# EAGLE board BIM_V2 (EAGLE 9.1.3)
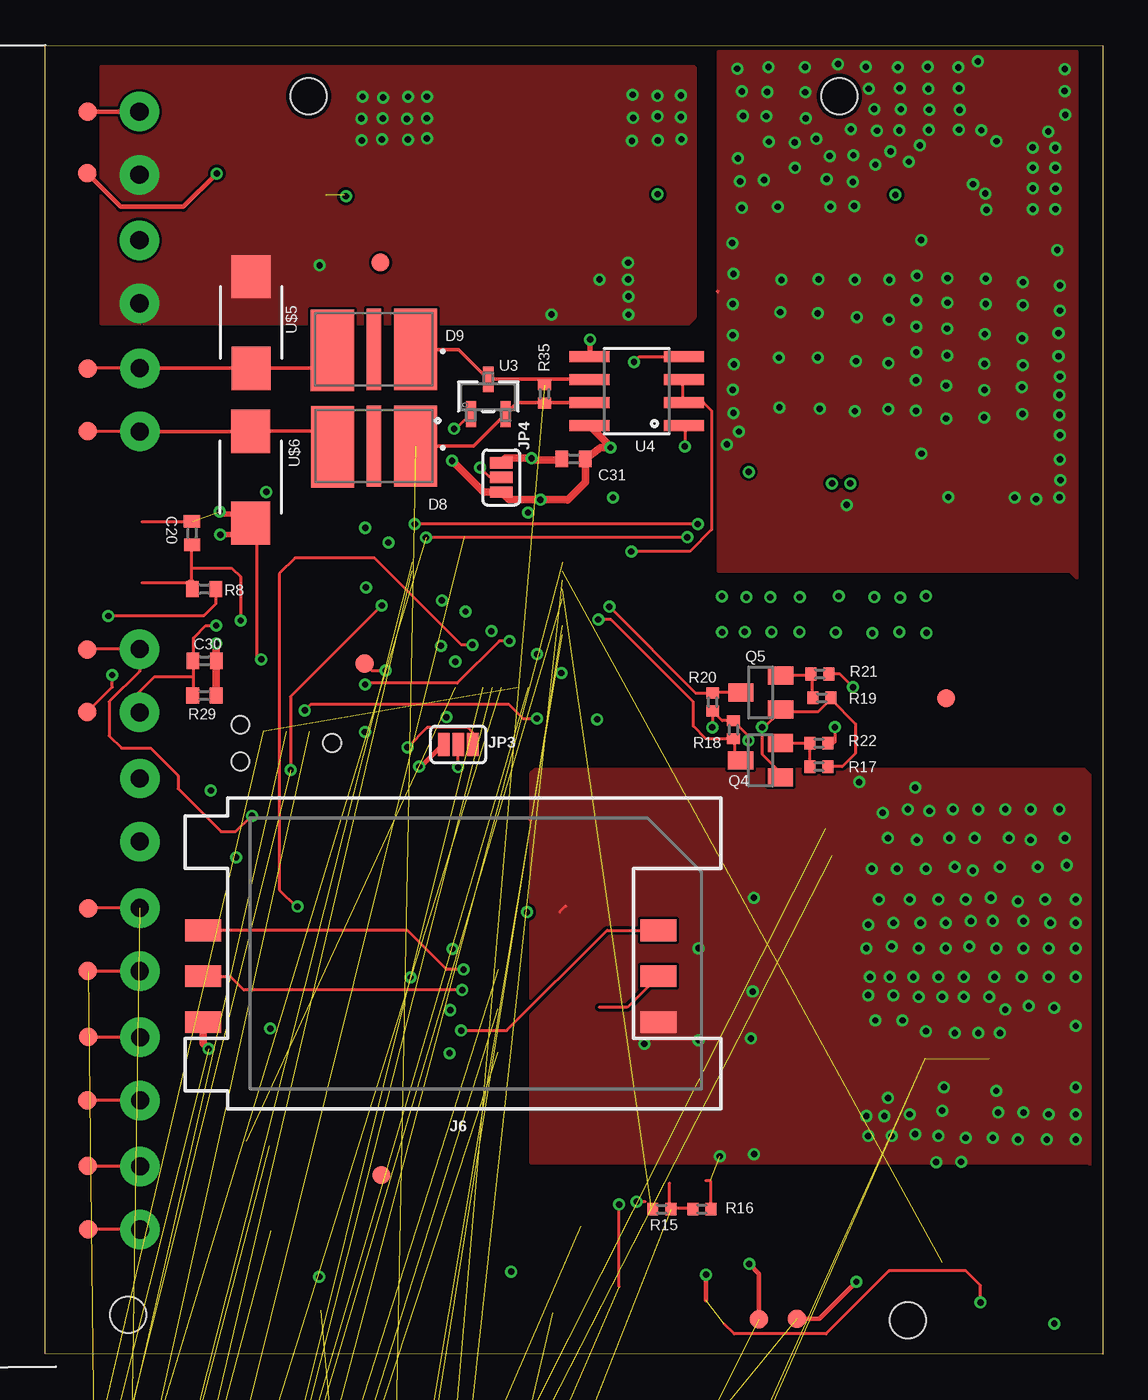
[diagram p7: board, top side]
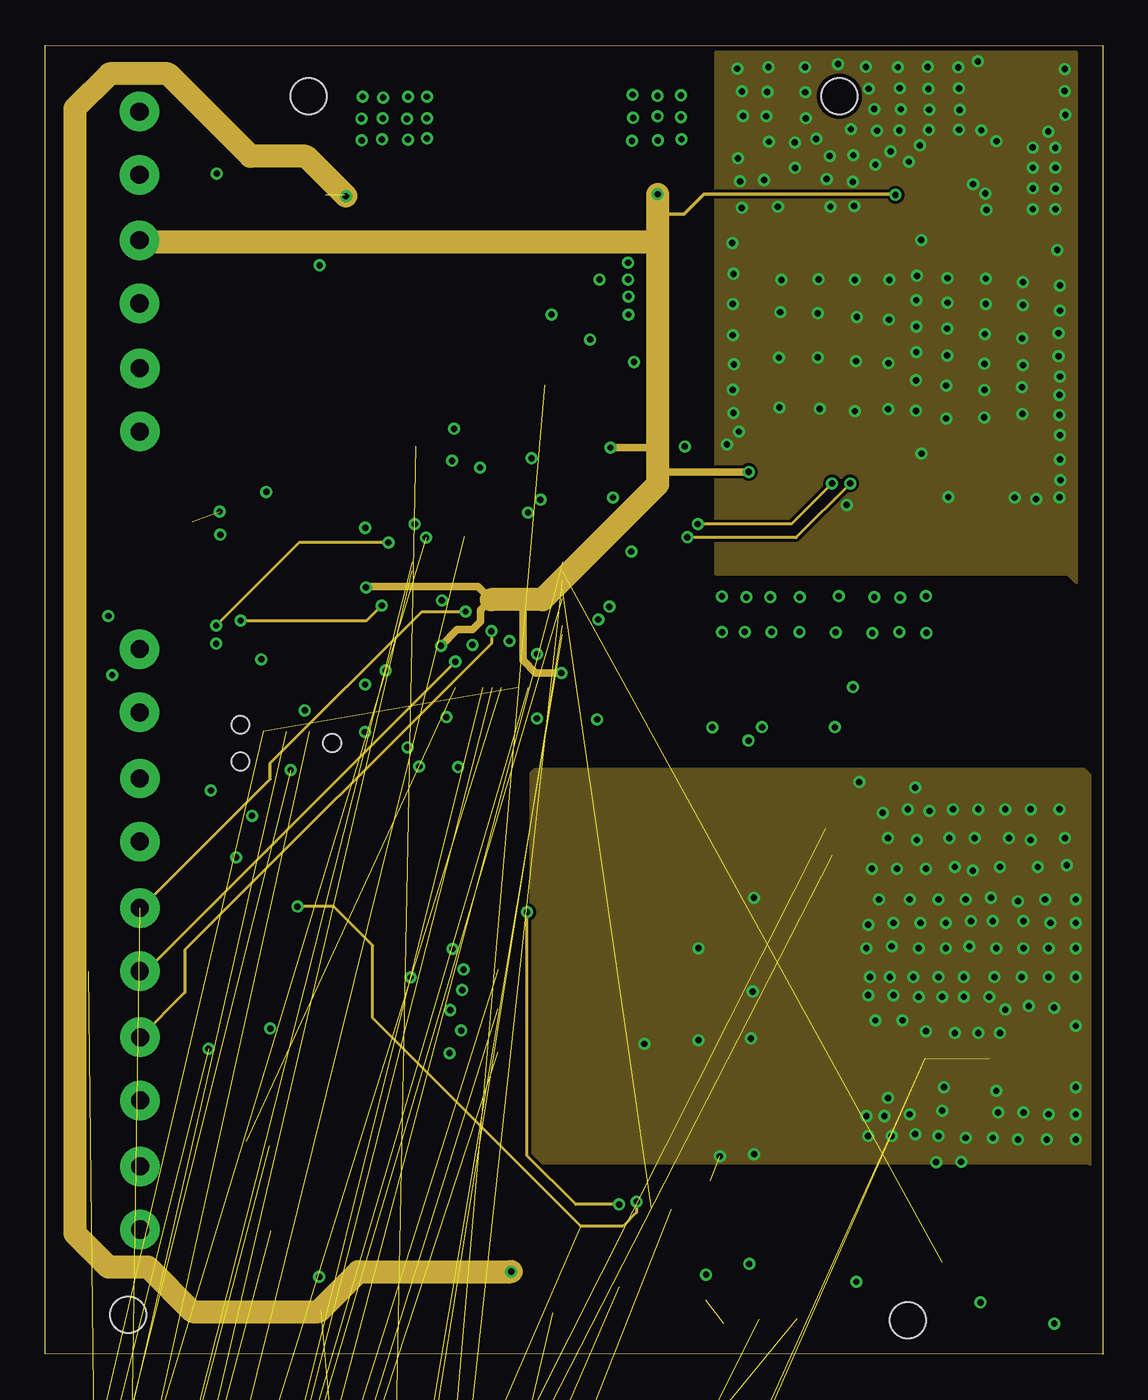
[diagram p8: board, inner layer Route2]
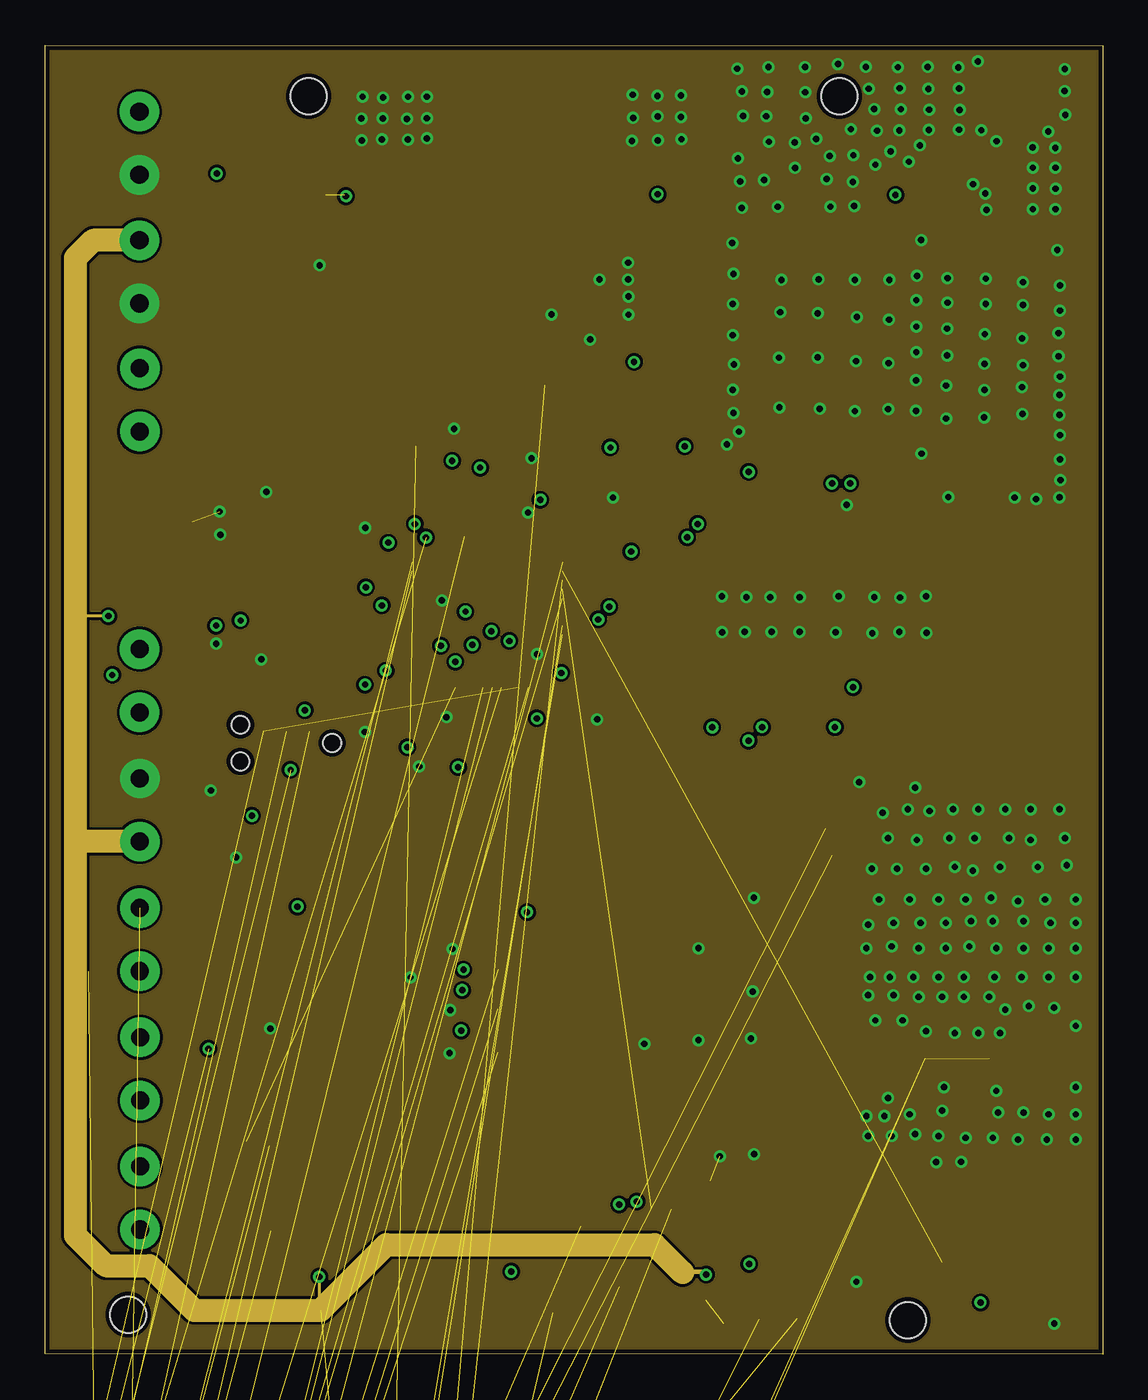
[diagram p9: board, inner layer Route15]
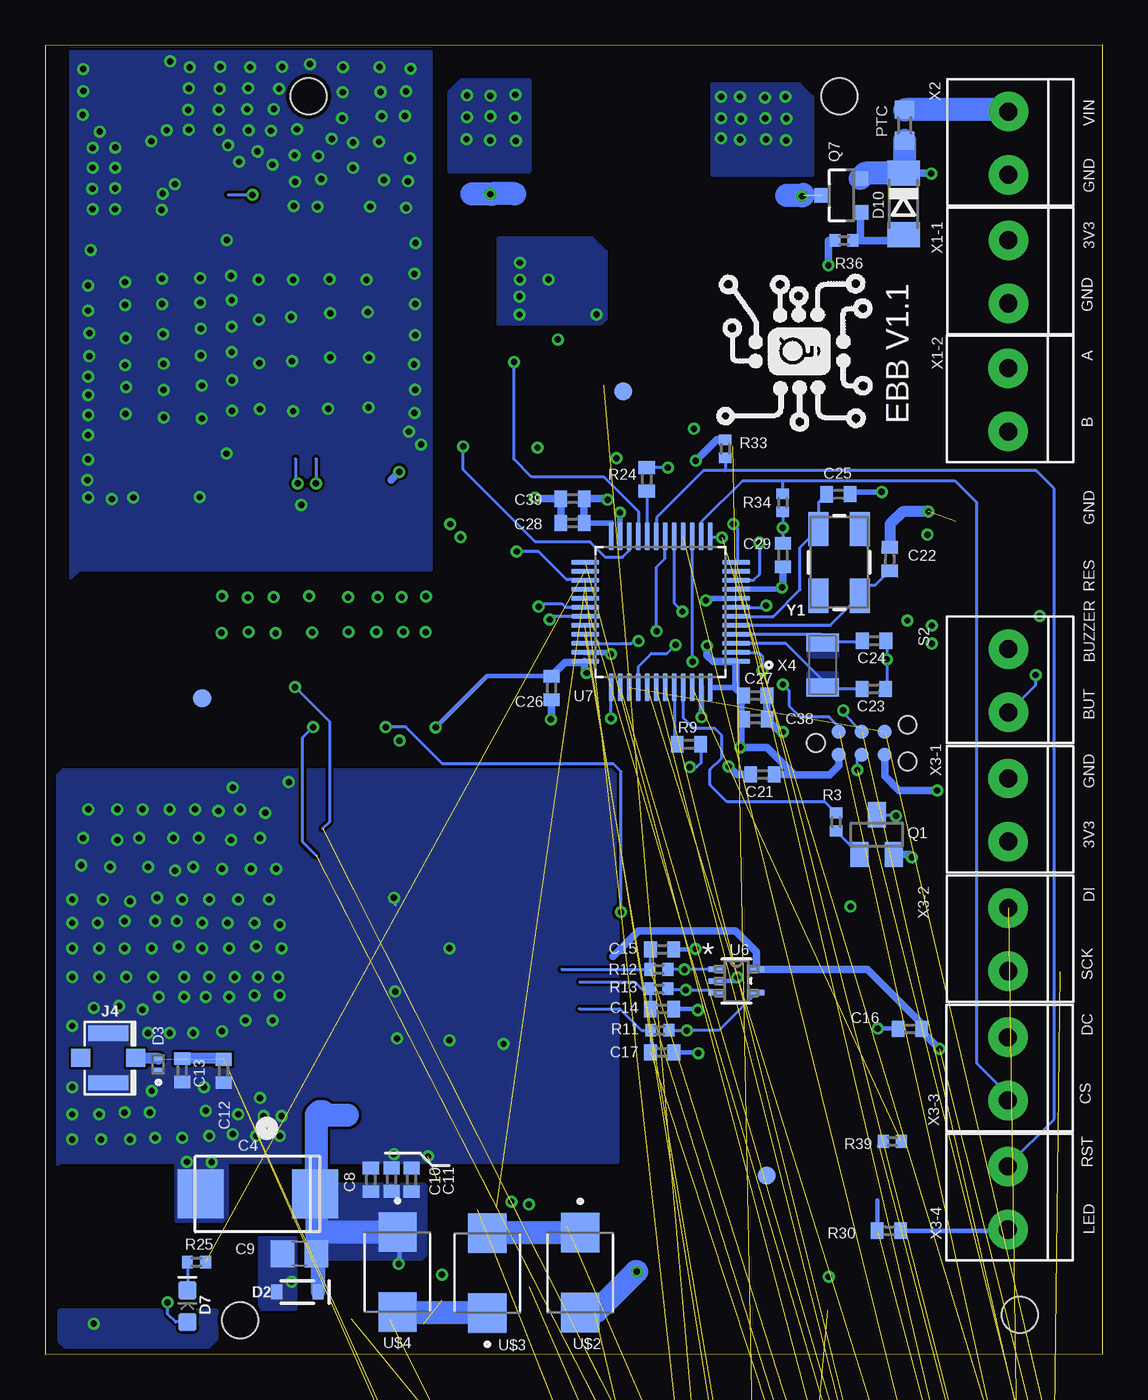
[diagram p10: board, bottom side, seen from below]

Size 58.6 x 72.53 mm. Coordinates in mm from the lower left corner, seen from the top.
Outline: 58.6,0 0,0.02 0,72.53 58.6,72.5 58.6,0
Copper layers (1+2*15+16): Top 0.035mm / dielectric 0.11mm / Route2 0.035mm / dielectric 0.6mm / Route15 0.035mm / dielectric 0.11mm / Bottom 0.035mm
Design rules "default *": minimum track width 6mil, minimum drill 0.35mm, track to track 6mil, track to pad 6mil, pad to pad 6mil, via to via 6mil, smd to smd 2mil, copper to edge 10mil, drill to drill 6mil, minimum pad ring 10mil, minimum via ring 4mil, stop-mask expansion 4mil, vias tented up to drill 0.4mm, thermal gap 0mil
Net classes: 1 power: width 0.254 mm, drill 0.2 mm; 2 signal: width 0.203 mm, drill 0.2 mm; 3 INPUT: width 0.203 mm, drill 0.005 mm
Holes 2 mm at 44,69.7 14.6,69.7 4.6,2.2 47.8,1.9

## Footprints (pad centres in the part's own frame; a part is rotated, then mirrored left to right if it is on the bottom)
CR1220 = smd 3.2 x 3.2: +$1 -8.225,0; +$2 8.225,0 | smd 6.35 x 6.35: - 0,0
C0402 = smd 0.7 x 0.9: 1 -0.65,0; 2 0.65,0
D/7343-31R = smd 2.55 x 2.7: + 3.175,0; - -3.175,0
0603-NO = smd 1.1 x 1: 1 -0.85,0; 2 0.85,0
C0805 = smd 1.3 x 1.5: 1 -0.95,0; 2 0.95,0
C0603 = smd 1.1 x 1: 1 -0.85,0; 2 0.85,0
SOD-323 = smd 0.63 x 0.83: A 1.15,0; C -1.15,0
DIODFN100X60X40-2N = smd 0.28 x 0.52: 1 -0.325,0; 2 0.325,0
LED-0603 = smd 1 x 1: A -0.877,0; C 0.877,0
DIOC650X400X100N = smd 2.4 x 4.5: 1 -2.3,0; 3 2.3,0.05 | smd 0.8 x 4.5: 2 0,0
SOD80C = smd 1.4 x 1.8: A 1.7,0; C -1.7,0
FIDUCIAL-1X2 = smd 1 x 1: 1 0,0
SOIC8_150MIL = smd 0.6 x 2.2: 1 -1.905,-2.6; 2 -0.635,-2.6; 3 0.635,-2.6; 4 1.905,-2.6; 5 1.905,2.6; 6 0.635,2.6; 7 -0.635,2.6; 8 -1.905,2.6
U.FL = smd 2.2 x 0.85: 1 0,1.375; 2 0,-1.375 | smd 1.05 x 1: FEED 1.525,0; NC -1.525,0
SIMHOLDER = smd 2 x 1.2: C1 -12.61,-3.81; C2 -12.61,-1.27; C3 -12.61,1.27; C5 12.61,-3.81; C6 12.61,-1.27; C7 12.61,1.27
SMT-JUMPER_3_2-NC_PASTE_SILK = smd 0.635 x 1.27: 1 -0.813,0; 2 0,0; 3 0.813,0
0603 = smd 1.1 x 1: 1 -0.85,0; 2 0.85,0
IND_2520_TDK = smd 0.856 x 2: 1 -1.178,0; 2 1.178,0
R0603 = smd 1 x 1.1: 1 -0.85,0; 2 0.85,0
SOT23 = smd 1 x 1.4: 1 -0.95,-1.1; 2 0.95,-1.1; 3 0,1.1
SOT-23F = smd 0.8 x 0.9: 1 -0.95,-1.05; 2 0.95,-1.05; 3 0,1.05
CRYSTAL_8X3.8 = smd 1.3 x 1.9: P$1 -2.75,-1.6; P$2 2.75,-1.6; P$3 2.75,1.6; P$4 -2.75,1.6
R0402 = smd 0.7 x 0.9: 1 -0.65,0; 2 0.65,0
R0402' = smd 0.6 x 0.7: 1 -0.5,0; 2 0.5,0
1X2-3.5MM = drill 1 pad 2.184: 1 1.8,0; 2 -1.7,0
PAD.03X.04 = smd 1.016 x 1.016: P$1 0,0
SOT-23_ONS = smd 0.559 x 1.422: 1 -0.953,-0.965; 2 0.953,-0.965; 3 0,0.965
SO08 = smd 0.61 x 2.21: 1 -1.905,-2.616; 2 -0.635,-2.616; 3 0.635,-2.616; 4 1.905,-2.616; 5 1.905,2.616; 6 0.635,2.616; 7 -0.635,2.616; 8 -1.905,2.616
SC-88A-5_1P35X2P2_ONS = smd 0.876 x 0.305: 1 -1.111,0.65; 2 -1.111,0; 3 -1.111,-0.65; 4 1.111,-0.65; 5 1.111,0.65
QFP50P900X900X160-48N = smd 1.56 x 0.28: 1 -4.18,2.75; 2 -4.18,2.25; 3 -4.18,1.75; 4 -4.18,1.25; 5 -4.18,0.75; 6 -4.18,0.25; 7 -4.18,-0.25; 8 -4.18,-0.75; 9 -4.18,-1.25; 10 -4.18,-1.75; 11 -4.18,-2.25; 12 -4.18,-2.75; 25 4.18,-2.75; 26 4.18,-2.25; 27 4.18,-1.75; 28 4.18,-1.25; 29 4.18,-0.75; 30 4.18,-0.25; 31 4.18,0.25; 32 4.18,0.75; 33 4.18,1.25; 34 4.18,1.75; 35 4.18,2.25; 36 4.18,2.75 | smd 0.28 x 1.56: 13 -2.75,-4.18; 14 -2.25,-4.18; 15 -1.75,-4.18; 16 -1.25,-4.18; 17 -0.75,-4.18; 18 -0.25,-4.18; 19 0.25,-4.18; 20 0.75,-4.18; 21 1.25,-4.18; 22 1.75,-4.18; 23 2.25,-4.18; 24 2.75,-4.18; 37 2.75,4.18; 38 2.25,4.18; 39 1.75,4.18; 40 1.25,4.18; 41 0.75,4.18; 42 0.25,4.18; 43 -0.25,4.18; 44 -0.75,4.18; 45 -1.25,4.18; 46 -1.75,4.18; 47 -2.25,4.18; 48 -2.75,4.18
SOIC8_4P9X3P9MC_MCH = smd 1.981 x 0.559: 1 -2.464,1.905; 2 -2.464,0.635; 3 -2.464,-0.635; 4 -2.464,-1.905; 5 2.464,-1.905; 6 2.464,-0.635; 7 2.464,0.635; 8 2.464,1.905
FIL_B39162B9417K610 = smd 0.18 x 0.25: 1 -0.385,0; 2 0,-0.25; 3 0.385,-0.25; 4 0.385,0.25; 5 0,0.25
SIMCON_SIM7000E = smd 2 x 0.6: 1 -12,8; 2 -12,7; 3 -12,6; 4 -12,5; 5 -12,4; 6 -12,3; 7 -12,2; 8 -12,1; 9 -12,0; 10 -12,-1; 11 -12,-2; 12 -12,-3; 13 -12,-4; 14 -12,-5; 15 -12,-6; 16 -12,-7; 17 -12,-8; 35 12,-8; 36 12,-7; 37 12,-6; 38 12,-5; 39 12,-4; 40 12,-3; 41 12,-2; 42 12,-1; 43 12,0; 44 12,1; 45 12,2; 46 12,3; 47 12,4; 48 12,5; 49 12,6; 50 12,7; 51 12,8 | smd 0.6 x 2: 18 -8,-12; 19 -7,-12; 20 -6,-12; 21 -5,-12; 22 -4,-12; 23 -3,-12; 24 -2,-12; 25 -1,-12; 26 0,-12; 27 1,-12; 28 2,-12; 29 3,-12; 30 4,-12; 31 5,-12; 32 6,-12; 33 7,-12; 34 8,-12; 52 8,12; 53 7,12; 54 6,12; 55 5,12; 56 4,12; 57 3,12; 58 2,12; 59 1,12; 60 0,12; 61 -1,12; 62 -2,12; 63 -3,12; 64 -4,12; 65 -5,12; 66 -6,12; 67 -7,12; 68 -8,12
SOIC8_208MIL = smd 0.6 x 2.2: 1 -1.905,-3.315; 2 -0.635,-3.315; 3 0.635,-3.315; 4 1.905,-3.315; 5 1.905,3.315; 6 0.635,3.315; 7 -0.635,3.315; 8 -1.905,3.315
SON50P300X300X80-11N = smd 0.8 x 0.3: 1 -1.45,1; 2 -1.45,0.5; 3 -1.45,0; 4 -1.45,-0.5; 5 -1.45,-1; 6 1.45,-1; 7 1.45,-0.5; 8 1.45,0; 9 1.45,0.5; 10 1.45,1 | smd 1.7 x 2.48: 11 0,0
J-LINK_6-PIN_ADAPTER_S = smd 0.787 x 0.787: P$1 -1.27,-0.635; P$2 -1.27,0.635; P$3 0,-0.635; P$4 0,0.635; P$5 1.27,-0.635; P$6 1.27,0.635 | hole 0.991: -2.54,0; 2.54,1.016; 2.54,-1.016
DIOM5436X261N = smd 2.18 x 2.12: A 2.215,0; C -2.215,0
DO-214AA = smd 2.4 x 2.16: 1 -2.54,0; 2 2.54,0
XTAL_3215_N = smd 1 x 1.8: 1 -1.25,0; 2 1.25,0
CRYSTAL-SMD-5X3.2-4PAD = smd 1.9 x 1.1: 1 -1.85,-1.15; 2 1.85,-1.15; 3 1.85,1.15; 4 -1.85,1.15

## Placement (x,y rotation side)
B2  CR1220  [CR1220]  not placed on the board
C1  10uF  [C0402]  not placed on the board
C3  10uF  [C0402]  not placed on the board
C4  1000uF  [D/7343-31R]  46.82,8.89 0 bottom
C5  0.1uF  [0603-NO]  not placed on the board
C8  0.1uF  [C0402]  40.56,9.67 90 bottom
C9  22uF  [C0805]  44.52,5.58 180 bottom
C10  47pF  [C0402]  38.3,9.68 90 bottom
C11  0.1uF  [C0402]  39.41,9.69 90 bottom
C12  0.3p DNP  [C0402]  48.71,15.7 270 bottom
C13  DNP  [C0402]  51.01,15.72 270 bottom
C14  33pF  [C0402]  24.42,19.13 0 bottom
C15  33pF  [C0402]  24.41,22.44 0 bottom
C16  0.1uF  [C0402]  10.69,18.03 180 bottom
C17  22pF  [C0402]  24.41,16.74 0 bottom
C18  2.4p DNP  [C0402]  not placed on the board
C19  DNP  [C0402]  not placed on the board
C20  1uF  [C0402]  8.14,45.49 90.4 top
C21  1uF  [C0402]  18.87,32.12 180 bottom
C22  20pF  [C0402]  11.81,44.05 269.5 bottom
C23  12pF  [C0402]  12.69,36.86 179.6 bottom
C24  12pF  [C0402]  12.67,39.53 180 bottom
C25  20pF  [C0402]  14.65,47.65 180.6 bottom
C26  0.1uF  [C0402]  30.54,36.92 270 bottom
C27  0.1uF  [C0402]  19.26,36.49 0 bottom
C28  0.1uF  [C0402]  29.39,46.06 180 bottom
C29  0.1uF  [C0402]  17.73,44.27 90 bottom
C30  1uF  [C0402]  8.84,38.42 0 top
C31  0.1uF  [C0402]  29.28,49.6 180 top
C32  0.1uF  [C0402]  not placed on the board
C33  10uF  [C0603]  not placed on the board
C34  0.1uF  [C0402]  not placed on the board
C36  10uF  [C0603]  not placed on the board
C38  1uF  [C0402]  19.25,35.19 0 bottom
C39  1uF  [C0402]  29.38,47.4 180 bottom
C47  22uF  [C0603]  not placed on the board
C48  10uF  [C0402]  not placed on the board
C73  0.1uF  [C0402]  not placed on the board
C74  0.1uF  [C0402]  not placed on the board
D2  5.1V  [SOD-323]  44.63,3.46 180 bottom
D3  D5V0L1B2LP4-7B  [DIODFN100X60X40-2N]  52.33,16.06 90 bottom
D6  Green  [LED-0603]  not placed on the board
D7  Red  [LED-0603]  50.71,2.67 90 bottom
D8  TBU-CA065-200-WH  [DIOC650X400X100N]  18.22,50.32 180 top
D9  TBU-CA065-200-WH  [DIOC650X400X100N]  18.22,55.67 180 top
D10  MMSZ5232B-E3-08  [SOD80C]  11.05,63.73 270 bottom
D12  Orange  [LED-0603]  not placed on the board
FD1  FIDUCIAL1X2  [FIDUCIAL-1X2]  26.57,53.36 0 bottom
FD2  FIDUCIAL1X2  [FIDUCIAL-1X2]  49.9,36.36 0 bottom
FD3  FIDUCIAL1X2  [FIDUCIAL-1X2]  18.63,9.91 0 bottom
FD4  FIDUCIAL1X2  [FIDUCIAL-1X2]  18.63,9.92 0 top
FD5  FIDUCIAL1X2  [FIDUCIAL-1X2]  49.91,36.36 0 top
FD6  FIDUCIAL1X2  [FIDUCIAL-1X2]  18.58,60.48 0 top
IC1  RTC_PCF8523T  [SOIC8_150MIL]  not placed on the board
J3  U.FL  [U.FL]  not placed on the board
J4  U.FL  [U.FL]  55.1,16.42 0 bottom
J6  NSIM-2-C  [SIMHOLDER]  21.36,22.21 0 top
JP3  JUMPER-SMT_3_2-NC_PASTE_SILK  [SMT-JUMPER_3_2-NC_PASTE_SILK]  22.89,33.79 0 top
JP4  JUMPER-SMT_3_2-NC_PASTE_SILK  [SMT-JUMPER_3_2-NC_PASTE_SILK]  25.27,48.58 270 top
L1  1uH DNP  [0603]  not placed on the board
L2  27uH  [0603]  not placed on the board
L3  MLP2520S1R5MT0S1  [IND_2520_TDK]  not placed on the board
PTC  PRG18BC1R0MM1RB  [R0603]  10.98,68.09 90 bottom
Q1  BSS123  [SOT23]  12.53,28.79 0 bottom
Q2  BSS123  [SOT23]  not placed on the board
Q3  BSS123  [SOT23]  not placed on the board
Q4  BSS123  [SOT23]  39.63,32.91 90 top
Q5  BSS123  [SOT23]  39.64,36.67 90 top
Q6  BSS123  [SOT23]  not placed on the board
Q7  SSM3J328R  [SOT-23F]  14.49,64.21 90 bottom
Q8  BSS123  [SOT23]  not placed on the board
Q9  BSS123  [SOT23]  not placed on the board
Q10  BSS123  [SOT23]  not placed on the board
Q11  32.768  [CRYSTAL_8X3.8]  not placed on the board
R1  4.7k  [R0402]  not placed on the board
R2  4.7k  [R0402]  not placed on the board
R3  1k  [R0402']  14.78,29.49 90 bottom
R5  60R  [R0402']  not placed on the board
R6  60R  [R0402']  not placed on the board
R8  10k  [R0402]  8.81,42.4 0 top
R9  100k  [R0402]  22.93,33.8 0 bottom
R10  10R  [R0402']  not placed on the board
R11  22R  [R0402']  24.55,17.96 0 bottom
R12  22R  [R0402']  24.59,21.32 0 bottom
R13  22R  [R0402']  24.59,20.26 0 bottom
R14  1k  [R0402]  not placed on the board
R15  4.7k  [R0402']  34.16,8.04 0 top
R16  4.7k  [R0402']  36.39,8.05 0 top
R17  10k  [R0402']  42.87,32.56 0 top
R18  10k  [R0402']  38.13,34.6 90 top
R19  10k  [R0402']  43.03,36.37 0 top
R20  10k  [R0402']  36.98,36.13 270 top
R21  1k  [R0402']  42.92,37.69 0 top
R22  1k  [R0402']  42.87,33.86 0 top
R23  10k  [R0402']  not placed on the board
R24  100k  [R0402]  25.27,48.48 90 bottom
R25  1k  [R0402']  50.21,5.11 0 bottom
R29  10k  [R0402]  8.83,36.5 180 top
R30  220R  [R0402]  11.85,6.85 180 bottom
R31  1k  [R0402']  not placed on the board
R32  1k  [R0402']  not placed on the board
R33  10k  [R0402']  20.91,50.16 270 bottom
R34  10k  [R0402']  17.73,47.17 90 bottom
R35  220R/120R  [R0402']  27.67,53.21 270 top
R36  1k  [R0402']  14.34,61.71 180 bottom
R39  1k  [R0402']  11.66,11.8 0 bottom
R40  10k  [R0402']  not placed on the board
R41  10k  [R0402']  not placed on the board
R42  10k  [R0402']  not placed on the board
R43  1k  [R0402']  not placed on the board
R44  1k  [R0402']  not placed on the board
R45  10k  [R0402']  not placed on the board
R46  10k  [R0402']  not placed on the board
R47  1k  [R0402']  not placed on the board
R48  4.7k  [R0402']  not placed on the board
R49  4.7k  [R0402']  not placed on the board
R50  1k  [R0402']  not placed on the board
R51  1k  [R0402']  not placed on the board
S2  1X2-3.5MM  [1X2-3.5MM]  5.23,37.27 90 bottom
S3  1X2-3.5MM  [1X2-3.5MM]  not placed on the board
S4  1X2-3.5MM  [1X2-3.5MM]  not placed on the board
TP1  TEST-POINT3X4  [PAD.03X.04]  2.36,68.84 0 top
TP2  TEST-POINT3X4  [PAD.03X.04]  41.65,1.98 0 top
TP3  TEST-POINT3X4  [PAD.03X.04]  2.32,65.43 0 top
TP4  TEST-POINT3X4  [PAD.03X.04]  not placed on the board
TP5  TEST-POINT3X4  [PAD.03X.04]  not placed on the board
TP6  TEST-POINT3X4  [PAD.03X.04]  not placed on the board
TP7  TEST-POINT3X4  [PAD.03X.04]  39.56,1.95 270 top
TP8  TEST-POINT3X4  [PAD.03X.04]  not placed on the board
TP10  TEST-POINT3X4  [PAD.03X.04]  not placed on the board
TP12  TEST-POINT3X4  [PAD.03X.04]  not placed on the board
TP13  TEST-POINT3X4  [PAD.03X.04]  17.7,38.28 270 top
TP14  TEST-POINT3X4  [PAD.03X.04]  2.34,39.04 0 top
TP15  TEST-POINT3X4  [PAD.03X.04]  2.34,35.59 0 top
TP16  TEST-POINT3X4  [PAD.03X.04]  2.38,24.7 0 top
TP17  TEST-POINT3X4  [PAD.03X.04]  2.36,21.25 0 top
TP18  TEST-POINT3X4  [PAD.03X.04]  2.39,17.58 0 top
TP19  TEST-POINT3X4  [PAD.03X.04]  2.34,14.08 0 top
TP20  TEST-POINT3X4  [PAD.03X.04]  2.37,10.44 0 top
TP21  TEST-POINT3X4  [PAD.03X.04]  2.38,6.93 0 top
TP23  TEST-POINT3X4  [PAD.03X.04]  2.36,54.6 0 top
TP24  TEST-POINT3X4  [PAD.03X.04]  2.36,51.15 0 top
TP30  TEST-POINT3X4  [PAD.03X.04]  not placed on the board
TP31  TEST-POINT3X4  [PAD.03X.04]  not placed on the board
TP32  TEST-POINT3X4  [PAD.03X.04]  not placed on the board
TP33  TEST-POINT3X4  [PAD.03X.04]  not placed on the board
TP34  TEST-POINT3X4  [PAD.03X.04]  not placed on the board
TP35  TEST-POINT3X4  [PAD.03X.04]  not placed on the board
U3  SESDONCAN1LT3G  [SOT-23_ONS]  24.55,53.05 0 top
U4  RS485SOIC  [SO08]  32.77,53.36 90 top
U6  SMF05T1G  [SC-88A-5_1P35X2P2_ONS]  20.3,20.68 0 bottom
U7  STM32F103C8T6  [QFP50P900X900X160-48N]  24.5,41.13 180 bottom
U8  ATA6561-GAQW-N  [SOIC8_4P9X3P9MC_MCH]  not placed on the board
U9  B39162B8813P810  [FIL_B39162B9417K610]  not placed on the board
U10  SIM7000E  [SIMCON_SIM7000E]  not placed on the board
U20  Generic SPI Flash  [SOIC8_208MIL]  not placed on the board
U40  ADP2504ACPZ-R7  [SON50P300X300X80-11N]  not placed on the board
U$1  J-LINK_6-PIN_ADAPTER-1  [J-LINK_6-PIN_ADAPTER_S]  13.36,33.87 0 bottom
U$2  0ohm 2010 resistor  [DIOM5436X261N]  28.95,4.53 270 bottom
U$3  0ohm 2010 resistor  [DIOM5436X261N]  34.1,4.51 90 bottom
U$4  HS3FB  [DIOM5436X261N]  39.08,4.56 270 bottom
U$5  TISP4240M3BJR-S  [DO-214AA]  11.4,57.16 270 top
U$6  TISP4240M3BJR-S  [DO-214AA]  11.4,48.59 90 top
X1-1  1X2-3.5MM  [1X2-3.5MM]  5.22,59.92 90 bottom
X1-2  1X2-3.5MM  [1X2-3.5MM]  5.25,52.83 90 bottom
X2  1X2-3.5MM  [1X2-3.5MM]  5.22,67.05 90 bottom
X3-1  1X2-3.5MM  [1X2-3.5MM]  5.25,30.1 90 bottom
X3-2  1X2-3.5MM  [1X2-3.5MM]  5.25,22.93 90 bottom
X3-3  1X2-3.5MM  [1X2-3.5MM]  5.26,15.77 90 bottom
X3-4  1X2-3.5MM  [1X2-3.5MM]  5.26,8.62 90 bottom
X4  32.768kHz  [XTAL_3215_N]  15.52,38.19 90 bottom
Y1  8MHz  [CRYSTAL-SMD-5X3.2-4PAD]  14.6,43.88 270 bottom

## Tracks (layer width: path | path; a pad name or v marks a point on that pad's centre or on a via)
3.3V  (via drill 0.35)  (21 unrouted)
  Top 0.152: 25.23,47.88 JP4.3 | 23.7,33.31 23.7,33.69 JP3.3 | 23.58,33.81 JP3.3 | v51.82,2.88 51.82,3.82 51.02,4.62 46.75,4.62 43.26,1.13 38.18,1.13 37.62,1.69 | 38.1,35.12 R18.2 | v38.98,34 38.98,34.25 38.23,35 R18.2 | R18.2 37.51,35.1 R20.2 36.96,35.62 v36.96,34.74 | R8.2 9.46,41.59 8.81,40.94 3.54,40.94 v3.5,40.9 | JP3.3 23.7,34.44 23.42,34.72 21.16,34.72 v20.07,33.63
  Top 0.254: 36.62,3.01 v36.62,4.42
  Top 0.406: U4.8 31.32,50.3 v31.32,50.24 30.76,50.24 C31.1 29.93,48.33 28.94,47.34 28.93,47.35 v27.44,47.35 25.69,47.35 JP4.3 24.29,47.77 v22.55,49.51
  Route2 0.184: v47.11,64.24 47.08,64.27 36.49,64.27
  Route2 0.203: 36.49,64.27 35.38,63.16 33.94,63.16
  Route2 0.406: v38.98,48.89 33.98,48.89 33.94,48.85 | v31.32,50.24 33.91,50.24 33.94,50.21 | v28.6,37.75 27.18,37.75 26.47,38.46 26.47,41.81 | v21.93,39.25 22.82,40.15 23.68,40.15 24.13,40.6 24.13,41.23 24.71,41.81 23.99,42.53 17.81,42.53 v17.77,42.49
  Route2 1.27: X1-1.1 5.3,61.65 33.82,61.65 33.94,61.53 | 24.71,41.81 26.47,41.81 27.56,41.81 33.94,48.19 33.94,48.85 33.94,50.21 33.94,61.53 | v33.94,64.27 33.94,63.16 33.94,61.53
  Route15 0.152: v15.19,4.3 15.19,2.5 15.26,2.43 | v3.5,40.9 1.84,40.9 1.68,41.06
  Route15 0.254: 35.26,4.58 36.46,4.58 v36.62,4.42
  Route15 1.27: X1-1.1 2.67,61.72 1.68,60.73 1.68,41.06 1.68,28.41 | 1.68,28.41 1.68,6.59 3.36,4.91 5.79,4.91 8.27,2.43 15.26,2.43 18.9,6.07 33.77,6.07 35.26,4.58 35.32,4.52 | X3-1.2 1.69,28.4 1.68,28.41
  Bottom 0.152: 20.05,35.34 C38.1 | 17.85,43.5 C29.1 | 30.48,37.62 C26.1 | 28.73,38.38 U7.36 28.68,38.36 | v33.94,64.27 33.85,64.38 33.85,64.29 33.85,64.27 | 27.23,46.06 27.23,45.38 U7.24 | 28.77,45.95 C28.1 | D7.A 51.38,1.8 51.8,2.22 51.8,2.86 v51.82,2.88 | v15.18,4.31 v15.19,4.3 | 19.95,36.46 C27.1 20.04,36.37 | 48.46,64.24 v47.11,64.24
  Bottom 0.203: 34.98,64.33 34.95,64.29
  Bottom 0.254: C26.1 34.13,37.57 v36.96,34.74
  Bottom 0.305: C28.1 27.23,46.06 | U7.48 20.37,36.95 | U7.9 17.88,42.38 v17.77,42.49
  Bottom 0.406: C28.1 C39.1 27.49,47.4 v27.44,47.35 | C26.1 29.8,38.31 28.73,38.31 28.68,38.36 | v28.6,37.75 28.73,37.88 28.73,38.38 | 20.05,35.34 20.05,36.35 C27.1 20.37,36.95 20.32,37.01 U7.1 21.59,38.38 21.93,38.73 v21.93,39.25 | C29.1 17.73,42.53 v17.77,42.49 | 39.43,48.44 v38.98,48.89 | 17.09,32.1 17.09,32.11 18.61,33.63 v20.07,33.63 20.06,33.64 20.06,35.03 C38.1 | 17.09,32.1 15.16,32.1 14.63,32.63 U$1.P$1 | C21.1 17.11,32.12 17.09,32.1 | R33.1 21.39,50.66 v22.55,49.51
  Bottom 1.27: 34.95,64.29 33.85,64.29 | 32.57,64.3 33.83,64.3 33.85,64.27
5V  (via drill 0.35)  (9 unrouted)
  Route2 1.27: v16.67,64.16 14.46,66.37 11.38,66.37 6.81,70.94 3.57,70.94 1.65,69.02 1.65,6.7 3.5,4.85 5.7,4.85 8.18,2.37 15.15,2.37 17.36,4.58 v25.82,4.58
  Bottom 0.203: 17.66,64.36 17.51,64.21
  Bottom 1.27: 17.51,64.21 16.6,64.21 16.6,64.25 v16.67,64.16 | v25.82,4.58 25.88,4.58 28.14,2.32 U$2.A
A  (2 unrouted)
  Top 0.203: D9.1 22.9,55.67 U3.3 27.69,54.02 | 27.69,54.02 30.14,54.02 U4.6 | R35.1 27.69,53.73 27.69,54.02
B  (2 unrouted)
  Top 0.152: R35.2 27.6,52.75 27.6,52.73
  Top 0.203: D8.1 23.74,50.32 U3.2 26.15,52.73 27.6,52.73 U4.7
BMS_RTS  (via drill 0.35)  (1 unrouted)
  Top 0.152: U4.3 35.35,53.88 35.35,52.75 U4.2 36.48,52.73 36.92,52.28 36.92,45.69 35.71,44.48 v32.48,44.48
  Bottom 0.152: U7.27 28.69,42.92 29.71,42.92 31.27,44.48 v32.48,44.48
BMS_RXD  (via drill 0.35)
  Top 0.152: U4.4 35.35,55.25 32.9,55.25 v32.62,54.98
  Bottom 0.152: v32.62,54.98 32.62,49.59 31.64,48.6 27.64,48.6 25.74,46.7 25.74,45.32 U7.21
BMS_TXD  (via drill 0.35)
  Top 0.152: v35.44,50.3 35.44,51.41 U4.1
  Bottom 0.152: v35.44,50.3 35.44,49.01 31.44,45.01 28.41,45.01 27.57,44.17 26.6,44.17 26.24,44.53 U7.22
BOOT0  (via drill 0.35)
  Top 0.152: v22.88,32.53 v22.89,32.54 JP3.2
  Bottom 0.152: R9.2 22.28,32.76 22.51,32.53 v22.88,32.53
BOOT1  (via drill 0.35)
  Top 0.152: v24.1,49.12 24.6,48.62 25.23,48.62 JP4.2
  Bottom 0.152: v24.1,49.12 25.23,49.12 R24.2
BUTTON  (via drill 0.35)
  Top 0.152: 8.1,38.38 C30.1 | 8.22,36.5 R29.2 8.19,36.52 8.19,37.53 | C30.1 8.22,38.5 8.22,39.7 8.9,40.38 v9.47,40.38 | C30.1 8.19,37.53 | 8.19,37.53 6.05,37.53 5.21,36.69 5.21,35.59 S2.2 | TP15.P$1 3.72,36.97 v3.72,37.64
  Route2 0.152: v9.47,40.38 14.07,44.97 v19.02,44.97
  Bottom 0.152: U7.10 19.34,42.88 19,43.23 19,44.95 v19.02,44.97 | S2.2 3.72,37.08 v3.72,37.64
BUZZER
  Bottom 0.152: R3.2 15.4,30.61 20.82,30.61 21.76,31.55 21.76,32.39 21.11,33.04 21.11,34.28 21.49,34.66 22.64,34.66 23.25,35.27 U7.45
BUZZER_  (via drill 0.35)
  Top 0.152: v11.46,29.84 11.43,29.84 10.55,28.96 9.75,28.96 7.37,31.34 7.37,32.06 5.85,33.58 4.24,33.58 3.55,34.27 3.55,36.16 5.23,37.84 S2.1 2.37,39.07 TP14.P$1
  Bottom 0.152: Q1.3 11.51,29.89 v11.46,29.84
CAN_RX  (1 unrouted)
CAN_TX  (1 unrouted)
DTR  (2 unrouted)
FLASH_CS  (1 unrouted)
GND  (via drill 0.35)  (51 unrouted)
  Top 0.152: 9.47,38.5 C30.2 | 11.72,45.75 11.47,46 U$6.1 11.72,45.75 | 11.72,45.75 11.72,38.75 | 11.72,38.75 11.72,38.62 | R29.1 9.6,36.62 | 36.6,9.62 36.85,9.62 36.85,8.12 R16.2 36.98,8 | 5.35,46.12 8.1,46.12 C20.2 | 41.54,2.1 TP2.P$1 | 25.35,49.5 JP4.1 | JP3.1 21.95,33.69 | 26.85,29.62 26.9,29.62 | U3.1 23.48,52 22.73,51.25 v22.65,51.28 | 30.23,55.38 30.21,55.35 U4.5 | 37.23,58.88 37.3,58.88 | 11.72,38.75 v11.97,38.5 | 28.84,24.84 28.5,24.5 | C31.2 28.37,49.55
  Top 0.254: 21.95,33.69 20.84,32.57 v20.73,32.57 | v44.95,4.02 42.91,1.98 TP2.P$1
  Top 0.305: v30.19,56.23 30.19,55.36 30.21,55.35 | v9.67,46.69 9.8,46.56 10.85,46.56 11.36,46.05 U$6.1 10.74,45.4 10.71,45.4 10.69,45.41 v9.71,45.41
  Top 0.406: 9.6,36.62 9.47,36.75 9.47,38.5 | C30.2 9.47,38.43 v9.47,39.38 | 28.37,49.55 27.04,49.55 v26.95,49.64 25.52,49.64 JP4.1
  Bottom 0.152: 39.19,24.89 39.2,24.9 | 11.85,44.75 C22.1 | 13.97,47.62 C25.1 | 11.97,39.38 v11.97,38.5 11.97,36.88 C23.1 12.1,36.75 | C27.2 18.73,36.66 | 18.67,35.15 C38.2 18.73,35.01 18.73,35.5 | C29.2 17.71,45.77 v17.73,45.79 R34.1 | 30.02,46.08 C28.2 | 30.6,36.38 C26.2 | 15.1,61.62 R36.2 | 51.1,11.88 51.1,12 v51,12
  Bottom 0.254: C15.2 22.59,22.44 v22.57,22.46 | C14.2 22.5,19.13 v22.44,19.07 | C17.2 22.47,16.74 v22.41,16.68 | U6.2 20.45,20.68 v20.25,20.88 | v12.47,18.05 11.37,18.05 C16.2
  Bottom 0.305: U7.47 22.25,35.32 | U7.35 27.34,38.88 v27.25,38.79 | U7.8 21.87,41.88 v21.98,41.77 | v26.75,46.63 U7.23 | C25.1 13.88,47.78 v12.25,47.78
  Bottom 0.406: v31.46,47.46 31.4,47.4 C39.2 30.02,46.08 | C26.2 30.54,35.22 v30.58,35.18 | 22.25,35.32 v22.23,35.3 | C27.2 C38.2 17.89,34.48 v17.72,34.48 | C21.2 20.28,32.12 v20.73,32.57 | U$1.P$5 12.09,32.04 11.29,31.24 v9.18,31.24 | v15.2,60.33 15.2,61.7 R36.2 | Q1.2 10.73,27.69 v10.58,27.54 | C24.1 12.02,39.42 11.97,39.38
  Bottom 0.61: v9.67,46.69 11.09,46.69 11.79,45.99 11.79,44.81 11.85,44.75
  other vias: 35.22,69.75 33.93,69.72 32.55,69.79 35.23,68.54 33.94,67.26 32.52,67.23 35.25,67.31 33.93,68.58 32.57,68.5 21.15,67.37 20.1,67.3 18.66,67.31 17.55,67.26 21.15,68.48 20.05,68.44 18.7,68.47 17.53,68.46 17.59,69.67 18.72,69.63 20.11,69.67 21.15,69.67 54.72,65.74 54.72,64.6 54.72,63.44 54.71,66.86 45.63,70.12 48.46,66.98 56.49,71.2 48.9,71.33 43.47,66.39 46.84,66.64 51.67,71.63 56.52,68.67 56.48,69.99 55.97,65.74 55.98,64.58 55.98,63.44 56.08,61.18 56.22,59.21 56.22,57.83 56.15,56.57 56.15,55.3 56.22,54.16 56.2,53.15 56.2,52.04 56.22,50.93 56.22,49.58 56.26,48.43 56.2,47.48 54.9,47.39 53.71,47.46 50.04,47.5 54.18,59.4 54.18,58.13 54.13,56.29 54.18,54.8 54.12,53.58 54.14,52.09 52.12,59.6 52.12,58.19 52.06,56.52 52.04,54.88 52.04,53.43 52.02,51.91 50,59.62 50,58.27 49.98,56.83 49.98,55.34 49.92,53.67 49.92,51.84 48.3,59.75 48.27,58.4 48.27,56.94 48.27,55.53 48.25,53.97 48.25,52.27 48.56,49.91 48.53,61.73 44.75,64.95 47.85,66.07 44.64,67.88 45.47,71.32 51.87,67.81 55.97,66.84 47.24,71.31 50.59,71.29 46,65.9 44.82,63.62 52.15,63.4 42.72,67.33 42.14,68.48 44.77,66.43 43.51,63.58 43.3,65.12 40.59,63.58 41.55,65.73 40.1,67.18 40.01,69.94 38.35,71.22 39.95,68.59 41.53,67.13 39.83,65.06 38.6,63.51 38.5,64.98 38.38,66.26 38.67,68.61 38.6,69.97 38.07,61.57 38.14,59.86 38.09,58.19 38.09,56.46 38.16,54.84 38.09,53.44 38.14,52.15 38.44,51.12 37.77,50.41 40.79,59.53 40.72,57.74 40.66,55.22 40.68,52.46 42.85,59.55 42.8,57.67 42.8,55.23 42.91,52.38 44.86,59.53 44.97,57.47 44.93,55.02 44.86,52.26 46.71,52.37 46.73,54.91 46.75,57.32 46.77,59.53 57.1,18.2 55.9,19.2 54.5,19.3 53.2,19.1 52.9,17.8 51.7,17.8 50.4,17.8 48.8,17.9 47.5,18.5 46,18.5 45.6,19.9 47,19.9 48.4,19.8 49.7,19.8 50.9,19.8 52.3,19.8 57.1,20.9 55.6,20.9 54.1,20.9 52.6,20.9 50.9,20.9 49.5,20.9 48.1,20.9 46.8,20.9 45.7,20.9 57.1,14.8 57.1,13.3 57.1,11.9 55.6,13.3 54.2,13.4 52.8,13.4 52.7,14.6 55.5,11.9 53.9,11.9 52.5,12 49.5,12.1 49.7,13.5 49.8,14.8 48.2,12.2 46.9,12.1 45.6,12.1 45.5,13.2 46.5,13.2 47.9,13.3 46.7,14.2 57.1,22.5 55.6,22.5 54.2,22.5 52.7,22.5 51.2,22.6 49.9,22.5 48.4,22.5 46.9,22.6 45.5,22.5 45.6,23.8 47,23.9 48.5,23.9 49.9,23.9 51.3,24 52.5,24 54.2,24 55.7,23.9 57.1,23.9 57.1,25.2 55.4,25.2 53.9,25.1 52.4,25.3 51,25.2 49.5,25.2 47.9,25.2 46.2,25.2 45.8,26.9 47.2,26.9 48.8,26.9 50.4,27 51.4,26.8 52.9,27 55,27 56.6,27.1 56.5,28.6 54.6,28.5 53.4,28.6 51.5,28.6 50.1,28.6 48.3,28.5 48.2,31.4 46.7,28.6 46.4,30 47.8,30.2 49,30.1 50.3,30.2 51.7,30.2 53.2,30.2 54.6,30.2 56.2,30.2 45.1,31.7 39.1,17.5 39.2,20.1 36.2,17.4 33.2,17.2 36.2,22.5 48.8,42 47.37,41.93 45.94,41.95 43.97,42 41.81,41.95 40.17,41.95 48.83,39.97 45.83,39.95 43.8,40 39.27,25.3 44.41,47.06 55.91,1.7 38.85,41.95 37.5,41.99 41.8,40.03 40.25,40.03 38.76,40.03 37.51,40.01 47.33,40.03 37.38,10.97 39.28,11.09 43.93,71.48 42.1,71.31 40.07,71.31 42.11,69.92 32.3,60.48 32.3,59.54 28.06,57.61 32.32,58.6 30.71,59.55 32.32,57.6 55.58,67.74 50.63,70.13 48.94,70.11 47.34,70.14 52.09,64.31 51.41,64.82 52.71,67.21 46.09,67.79 48.98,68.95 45.93,68.99 47.41,68.98 50.67,68.94 50.63,67.84 48.96,67.83 47.33,67.81 50.75,10.67 49.37,10.65
  pour Route15: 58.6,72.3 0,72.3 0,0 58.6,0
  pour Bottom: 31.78,65.58 36.16,65.58 36.16,69.89 35.49,70.56 31.78,70.56
  pour Top: 35.97,71.34 3.09,71.34 3.09,57.1 35.69,57.1 36.03,57.44 36.03,71.29
  pour Bottom: 37.23,72.15 37.23,43.47 56.7,43.47 57.17,43 57.17,72.15
  pour Top: 37.3,72.17 37.3,43.39 56.77,43.39 57.17,43 57.17,72.17
  pour Bottom: 57.6,32.4 27.1,32.4 26.9,32.2 26.9,10.6 57.8,10.6 57.9,10.5 57.9,32.1
  pour Top: 57.6,32.4 27.1,32.4 26.9,32.2 26.9,10.6 57.8,10.6 57.9,10.5 57.9,32.1
  pour Bottom: 16.08,65.3 21.67,65.3 21.67,70.4 16.8,70.4 16.08,69.68
  pour Bottom: 46.75,6.47 46.75,2.63 46.63,2.51 44.7,2.51 44.7,6.47
  pour Bottom: 57.79,2.46 49.11,2.46 49.11,0.81 49.53,0.39 57.52,0.39 57.81,0.68 57.81,2.44
  pour Route2: 37.18,72.13 37.18,43.23 56.65,43.23 57.12,42.76 57.12,72.13
  pour Route2: 57.6,32.4 27.1,32.4 26.9,32.2 26.9,10.6 57.8,10.6 57.9,10.5 57.9,32.1
  pour Bottom: 33.47,61.86 28.29,61.86 27.52,61.09 27.52,57.35 27.81,57.06 33.48,57.06 33.48,61.85
  pour Bottom: 51.35,11.11 51.35,7.48 51.24,7.37 48.82,7.37 48.57,7.62 48.57,11.06 48.68,11.17 51.4,11.17
  pour Bottom: 51.34,11.17 51.34,7.37 48.76,7.37 48.51,7.62 48.51,11.06 48.62,11.17
GNSS_ANT  (1 unrouted)
GPS_RXD  (via drill 0.35)  (2 unrouted)
  Top 0.152: v36.16,46 v20.48,46
  Route2 0.152: v43.6,48.25 41.35,46 v36.16,46
  Bottom 0.152: 43.6,49.62 v43.6,48.25 | v20.48,46 20.23,45.76 20.23,43.97 U7.12
GPS_RXD_  (1 unrouted)
GPS_TXD  (via drill 0.35)  (2 unrouted)
  Top 0.152: v35.58,45.27 21.12,45.27 v21.1,45.25
  Route2 0.152: v44.6,48.25 41.6,45.25 35.6,45.25 v35.58,45.27
  Bottom 0.152: v21.1,45.25 21.73,45.25 U7.13 | v44.6,48.25 44.73,48.38 44.73,49.62
GPS_TXD_  (1 unrouted)
GSM_POWER  (1 unrouted)
  Top 0.152: 33.6,8.12 R15.1
GSM_RESET  (via drill 0.35)  (1 unrouted)
  Top 0.152: v13.98,24.81 13.9,24.81 12.97,25.73 12.97,43.25 13.85,44.12 18.24,44.12 23.06,39.3 v23.67,39.3 | 33.25,8.46 v32.77,8.46
  Route2 0.152: v32.77,8.46 32.77,7.86 32.01,7.1 29.69,7.1 18.15,18.64 18.15,22.65 15.99,24.81 v13.98,24.81
  Bottom 0.152: U7.40 25.73,37 25.73,38.12 25.01,38.84 24.14,38.84 v23.67,39.3
GSM_RXD  (via drill 0.35)
  Top 0.152: 38.23,37 38.48,36.75 Q5.3 37.01,36.67 R20.1 36.04,36.63 v31.25,41.42
  Bottom 0.152: U7.30 29.75,41.38 29.93,41.56 31.11,41.56 v31.25,41.42
GSM_TXD  (via drill 0.35)
  Top 0.152: R18.1 38.23,34 38.23,33.25 38.48,33 Q4.3 | v30.65,40.71 31.35,40.71 35.91,36.15 35.91,34.81 36.62,34.1 R18.1 | R18.1 37.95,34.1
  Bottom 0.152: U7.31 30.48,40.88 v30.65,40.71
LCD_CS
  Top 0.152: 5.35,14 X3-3.2 2.35,14.07 TP19.P$1
  Bottom 0.152: 17.74,48.38 8.17,48.38 6.97,47.18 6.97,16.12 5.35,14.5 5.35,14.12 X3-3.2 | 17.74,48.38 19.98,48.38 22.23,46.12 22.23,45.38 U7.14 | R34.2 17.73,48.37 17.74,48.38
LCD_DC  (via drill 0.35)
  Top 0.152: X3-3.1 2.4,17.57 TP18.P$1
  Route2 0.152: v24.72,40.06 24.72,39.38 7.74,22.4 7.74,20.05 X3-3.1
  Bottom 0.152: v24.72,40.06 24.72,43.62 24.25,44.1 U7.18
LCD_DI  (via drill 0.35)  (1 unrouted)
  Top 0.152: X3-2.1 2.41,24.73 TP16.P$1
  Route2 0.152: v23.29,41.15 20.88,41.15 12.47,32.75 12.47,31.88 5.35,24.75 X3-2.1
  Bottom 0.152: v23.29,41.15 23.73,41.59 23.73,45.25 U7.17
LCD_LED  (1 unrouted)
LCD_RST
  Top 0.152: X3-4.1 2.4,10.41 TP20.P$1
  Bottom 0.152: X3-4.1 5.22,10.5 2.7,13.03 2.7,47.95 3.7,48.95 20.92,48.95 | 20.92,48.95 22.12,48.95 24.73,46.34 24.73,45.38 U7.19 | R33.2 20.91,48.95 20.92,48.95
LCD_SCK  (via drill 0.35)  (1 unrouted)
  Top 0.152: X3-2.2 2.38,21.23 TP17.P$1
  Route2 0.152: v22.73,38.38 5.6,21.25 5.35,21.25 X3-2.2
  Bottom 0.152: v22.73,38.38 22.73,45.25 U7.15
MCU_RESET  (via drill 0.35)  (1 unrouted)
  Top 0.152: 8.1,43.56 8.1,44.75 C20.1 | 8.1,43.56 8.1,42.75 5.35,42.75 | v13.6,32.38 13.6,36.44 v18.65,41.48 | 8.1,43.56 10.34,43.56 10.82,43.08 v10.82,40.66 v10.83,40.66
  Top 0.406: R8.1 8.17,42.69 8.1,42.75
  Route2 0.152: v10.83,40.66 17.82,40.66 v18.65,41.48
  Bottom 0.152: v13.6,32.38 13.6,33 13.47,33.12 U$1.P$3 | U7.7 20.31,41.38 18.76,41.38 v18.65,41.48
N$2  (1 unrouted)
N$3  (2 unrouted)
N$4
  Bottom 0.152: Q1.1 R3.1
N$6  (1 unrouted)
N$7  (via drill 0.35)
  Top 0.152: 17.59,38.3 TP13.P$1 18.1,37.88 v18.87,37.88
  Bottom 0.152: U7.2 20.23,38.88 19.04,38.88 18.86,38.69 v18.86,37.89 v18.87,37.88
N$8  (1 unrouted)
N$9
  Bottom 0.152: R25.1 50.69,3.57 D7.C
N$11  (2 unrouted)
N$12  (1 unrouted)
N$14
  Top 0.152: U$5.2 | X1-2.1 2.39,54.62 TP23.P$1
  Top 0.203: X1-2.1 11.16,54.62 11.4,54.87 | 11.71,55.17 11.4,54.87 | 11.4,54.87 U$5.2 | U$5.2 14.92,54.62 D9.3
N$15  (1 unrouted)
N$16  (1 unrouted)
  Top 0.152: R16.1 35.85,8.12 34.73,8.12 R15.2 34.6,8.12 34.6,9.5
N$17  (2 unrouted)
N$19
  Bottom 0.152: U7.44 23.75,34.18 23.66,33.89 R9.1
N$20
  Bottom 0.152: R24.1 25.23,47.75 25.23,45.38 U7.20
N$22
  Bottom 0.152: 38.98,2.38 U$4.A
  Bottom 1.27: U$3.C 38.9,2.3 38.98,2.38
N$23  (1 unrouted)
  Bottom 0.152: 12.5,8.53
  Bottom 0.254: R30.2 12.5,8.53
N$24
  Top 0.152: X3-4.2 2.4,6.92 TP21.P$1
  Bottom 0.254: X3-4.2 5.32,6.85 R30.1
N$25  (1 unrouted)
  Bottom 0.254: 12.41,11.56 R39.1
N$30
  Bottom 0.152: 28.98,6.88 28.98,6.75 U$2.C | 34.1,6.75 U$3.A
  Bottom 1.27: U$2.C 34.08,6.75 U$3.A
N$31
  Top 0.152: X1-2.2 2.39,51.12 TP24.P$1
  Top 0.203: X1-2.2 11.39,51.12 U$6.2 15.06,51.13 D8.3
N$32
  Bottom 0.152: 13.4,61.71 R36.1
  Bottom 0.406: Q7.1 13.44,61.75 13.4,61.71 | R36.1 11.37,61.71 D10.A
N$37  (2 unrouted)
  Bottom 0.152: 50.98,16.12 51.01,16.16 51.01,16.33 C13.1
  Bottom 0.61: 48.75,16.39 50.95,16.39 51.01,16.33
N$38  (2 unrouted)
N$39  (1 unrouted)
N$40  (1 unrouted)
N$41  (1 unrouted)
N$42  (1 unrouted)
N$43  (1 unrouted)
N$44  (1 unrouted)
N$45  (1 unrouted)
N$46  (1 unrouted)
N$47  (1 unrouted)
N$48  (1 unrouted)
N$49  (1 unrouted)
N$50  (1 unrouted)
N$152  (1 unrouted)
N$156  (1 unrouted)
NRESET  (1 unrouted)
PC14
  Bottom 0.152: C23.2 15.47,36.88 X4.1 15.52,37.34 17.55,39.38 20.23,39.38 U7.3
  pour Bottom: 16.36,37.76 16.36,37.32 14.7,37.32 14.7,37.76
PC15
  Bottom 0.152: C24.2 13.35,39.5 15.47,39.5 X4.2 15.6,39.5 15.6,39.88 20.23,39.88 U7.4
  pour Bottom: 16.35,39.07 16.35,38.63 14.69,38.63 14.69,39.07
PD0
  Bottom 0.152: 13.35,42.62 13.35,42.12 Y1.3 | C22.2 12.59,42.62 13.35,42.62 | 13.35,42.62 Y1.3 | Y1.3 15.08,40.4 20.31,40.4 U7.5
PD1
  Bottom 0.152: C25.2 15.35,47.62 15.72,47.25 15.72,45.75 Y1.1 15.79,45.68 | 15.85,45.62 15.79,45.68 | U7.6 18.25,40.88 16.78,42.36 16.78,44.7 15.79,45.68
PWRKEY  (1 unrouted)
RF_ANT  (5 unrouted)
  Bottom 0.61: J4.FEED 53.55,16.39 D3.2 52.31,16.37 52.3,16.38 | 48.66,16.39 C12.1
RTC_INT  (1 unrouted)
SCL  (2 unrouted)
SDA  (2 unrouted)
SIM_CLK  (1 unrouted)
  Bottom 0.152: C15.1 25.05,22.42 25.05,21.37 R12.1 25.11,21.34 29.99,21.34
SIM_DATA  (1 unrouted)
  Bottom 0.152: 29,19.14 26.75,19.14 25.57,17.96 R11.1 25.05,16.75 C17.1
SIM_DTR  (1 unrouted)
SIM_RST  (1 unrouted)
  Bottom 0.152: 28.98,20.62 25.93,20.62 25.56,20.26 R13.1 25.07,20.24 C14.1
SIM_RXD  (via drill 0.35)  (1 unrouted)
  Top 0.152: v44.76,36.96 44.03,37.69 R21.2
  Bottom 0.152: v44.76,36.96 42.85,35.05 42.85,29.5 43.23,29.12
SIM_TXD  (via drill 0.35)  (1 unrouted)
  Top 0.152: v43.76,34.75 43.76,33.92 | 43.76,33.92 | 43.76,33.92 43.7,33.86 R22.2
  Bottom 0.152: v43.76,34.75 44.34,34.16 44.34,28.39 43.59,27.64
SIM_VCC  (via drill 0.35)  (1 unrouted)
  Top 0.152: 8.85,18.38 J6.C1
  Top 0.406: J6.C1 8.75,17.23 v9.05,16.93
  Bottom 0.152: 10.07,18.35 10.04,18.31 C16.1
  Bottom 0.406: C16.1 10.04,17.92 v9.05,16.93 | 27.14,22.04 25.72,23.46 20.35,23.46 19.19,22.3 U6.5 13.05,21.33 10.07,18.35
SIM_VPP
  Top 0.152: J6.C6 32.26,19.23 30.69,19.23
SIMCLK  (via drill 0.35)
  Top 0.152: J6.C3 8.85,23.38 | 8.85,23.38 | v23.18,21.32 22.24,21.32 20.07,23.49 8.96,23.49 8.85,23.38
  Bottom 0.152: U6.1 23.17,21.33 v23.18,21.32 R12.2
SIMDATA  (via drill 0.35)
  Top 0.152: 33.85,23.5 33.91,23.49 | 33.91,23.49 J6.C7 | v23.05,17.94 25.57,17.94 31.13,23.5 33.91,23.5 33.91,23.49
  Bottom 0.152: U6.4 21.27,17.96 23.07,17.96 v23.05,17.94 23.03,17.96 R11.2
SIMRST  (via drill 0.35)
  Top 0.152: 8.85,20.88 J6.C2 8.78,20.91 10.27,20.91 11,20.18 v23.11,20.18
  Bottom 0.152: R13.2 24.01,20.18 v23.11,20.18 21.56,20.18 U6.3
SIMRXD
  Top 0.152: R19.1 42.48,36.38 42.48,37.62 R21.1 42.35,37.62 40.85,37.62 Q5.2
SIMRXD1  (2 unrouted)
SIMTXD
  Top 0.152: R17.1 42.35,32.62 42.35,33.75 R22.1 42.35,33.88 40.85,33.88 Q4.2
SIMTXD1  (2 unrouted)
SIMTXD2  (2 unrouted)
SPI_MISO  (1 unrouted)
SWCLK  (via drill 0.35)  (1 unrouted)
  Top 0.152: v27.25,35.23 26.48,35.23 25.71,35.99 14.71,35.99 v14.38,35.67
  Bottom 0.152: v14.38,35.67 14.38,35.53 13.47,34.62 U$1.P$4 | v27.25,35.23 U7.37
SWDIO  (via drill 0.35)  (1 unrouted)
  Top 0.152: v25.72,39.52 25.16,39.52 22.83,37.19 17.79,37.19 | 17.8,37.2 17.79,37.19 | 17.79,37.19 17.72,37.13 v17.72,37.11
  Bottom 0.152: U7.34 26.11,39.38 25.98,39.52 v25.72,39.52 | v17.72,37.11 17.38,36.77 17.38,35.93 16.77,35.31 15.17,35.31 14.62,34.76 14.62,34.51 U$1.P$2
SWO  (2 unrouted)
V_BATT  (via drill 0.35)  (3 unrouted)
  Top 0.254: TP7.P$1 39.56,4.46 v39.01,5.01
  Bottom 0.152: 41.85,13.25 41.85,13.62 | U$4.C 38.98,6.75 | 42.91,13.25 43.15,13.49 43.23,13.57 43.23,13.45
  Bottom 0.254: 38.98,6.75 38.98,5.04 v39.01,5.01
  Bottom 0.406: C11.1 39.43,9.02 | C10.1 | 43.48,5.49 C9.1
  Bottom 0.813: D2.C 43.48,5.49
  Bottom 1.27: 43.6,5.61 C9.1 43.57,6.72 | 43.23,13.45 43.4,13.45 43.58,13.27 43.58,8.96 C4.+ 43.57,8.81 43.57,6.72 | 41.85,13.25 42.91,13.25 | 39.1,6.79 U$4.C 43.52,6.77 43.57,6.72
  pour Bottom: 43.05,9.44 37.59,9.44 37.53,9.38 37.53,5.45 37.71,5.27 42.99,5.27 43.03,5.23
VBAT1  (1 unrouted)
VDD_EXT  (via drill 0.35)  (7 unrouted)
  Top 0.152: 43.48,36.25 42.84,35.62 40.84,35.62 Q5.1 40.73,35.62 39.73,34.62 | 43.48,36.25 R19.2 | 39.73,34.62 39.73,33.25 40.73,32.25 40.73,32 Q4.1 | v39.73,34.75 39.73,34.62 | R17.2 44.16,32.56 44.9,33.3 44.9,34.92 43.52,36.3 43.48,36.25 | 31.8,3.75 v31.8,8.3
  Route2 0.152: v31.8,8.3 29.4,8.3 26.7,11 v26.7,24.5
  Bottom 0.152: 26.7,24.82 26.7,32.29 27.12,32.72 36.59,32.72 38.62,34.76 39.71,34.76 v39.73,34.75 | 26.7,24.82 26.7,24.84 | 26.7,24.82 v26.7,24.5
VIN
  Top 0.254: TP1.P$1 X2.1
  Bottom 1.27: X2.1 5.32,68.94 PTC.2
VIN__  (via drill 0.35)
  Top 0.254: TP3.P$1 4.18,63.57 7.66,63.57 v9.51,65.42
  Bottom 0.406: v9.51,65.42 9.52,65.43 11.7,65.43
  Bottom 1.27: Q7.2 13.16,65.43 11.7,65.43 D10.C 10.98,65.5 PTC.1

## Text on the board
bPlace: EBB V1.1
bNames: VIN | GND | 3V3 | GND | A | B | GND | RES | BUZZER | BUT | GND | 3V3 | DI | SCK | DC | CS | RST | LED